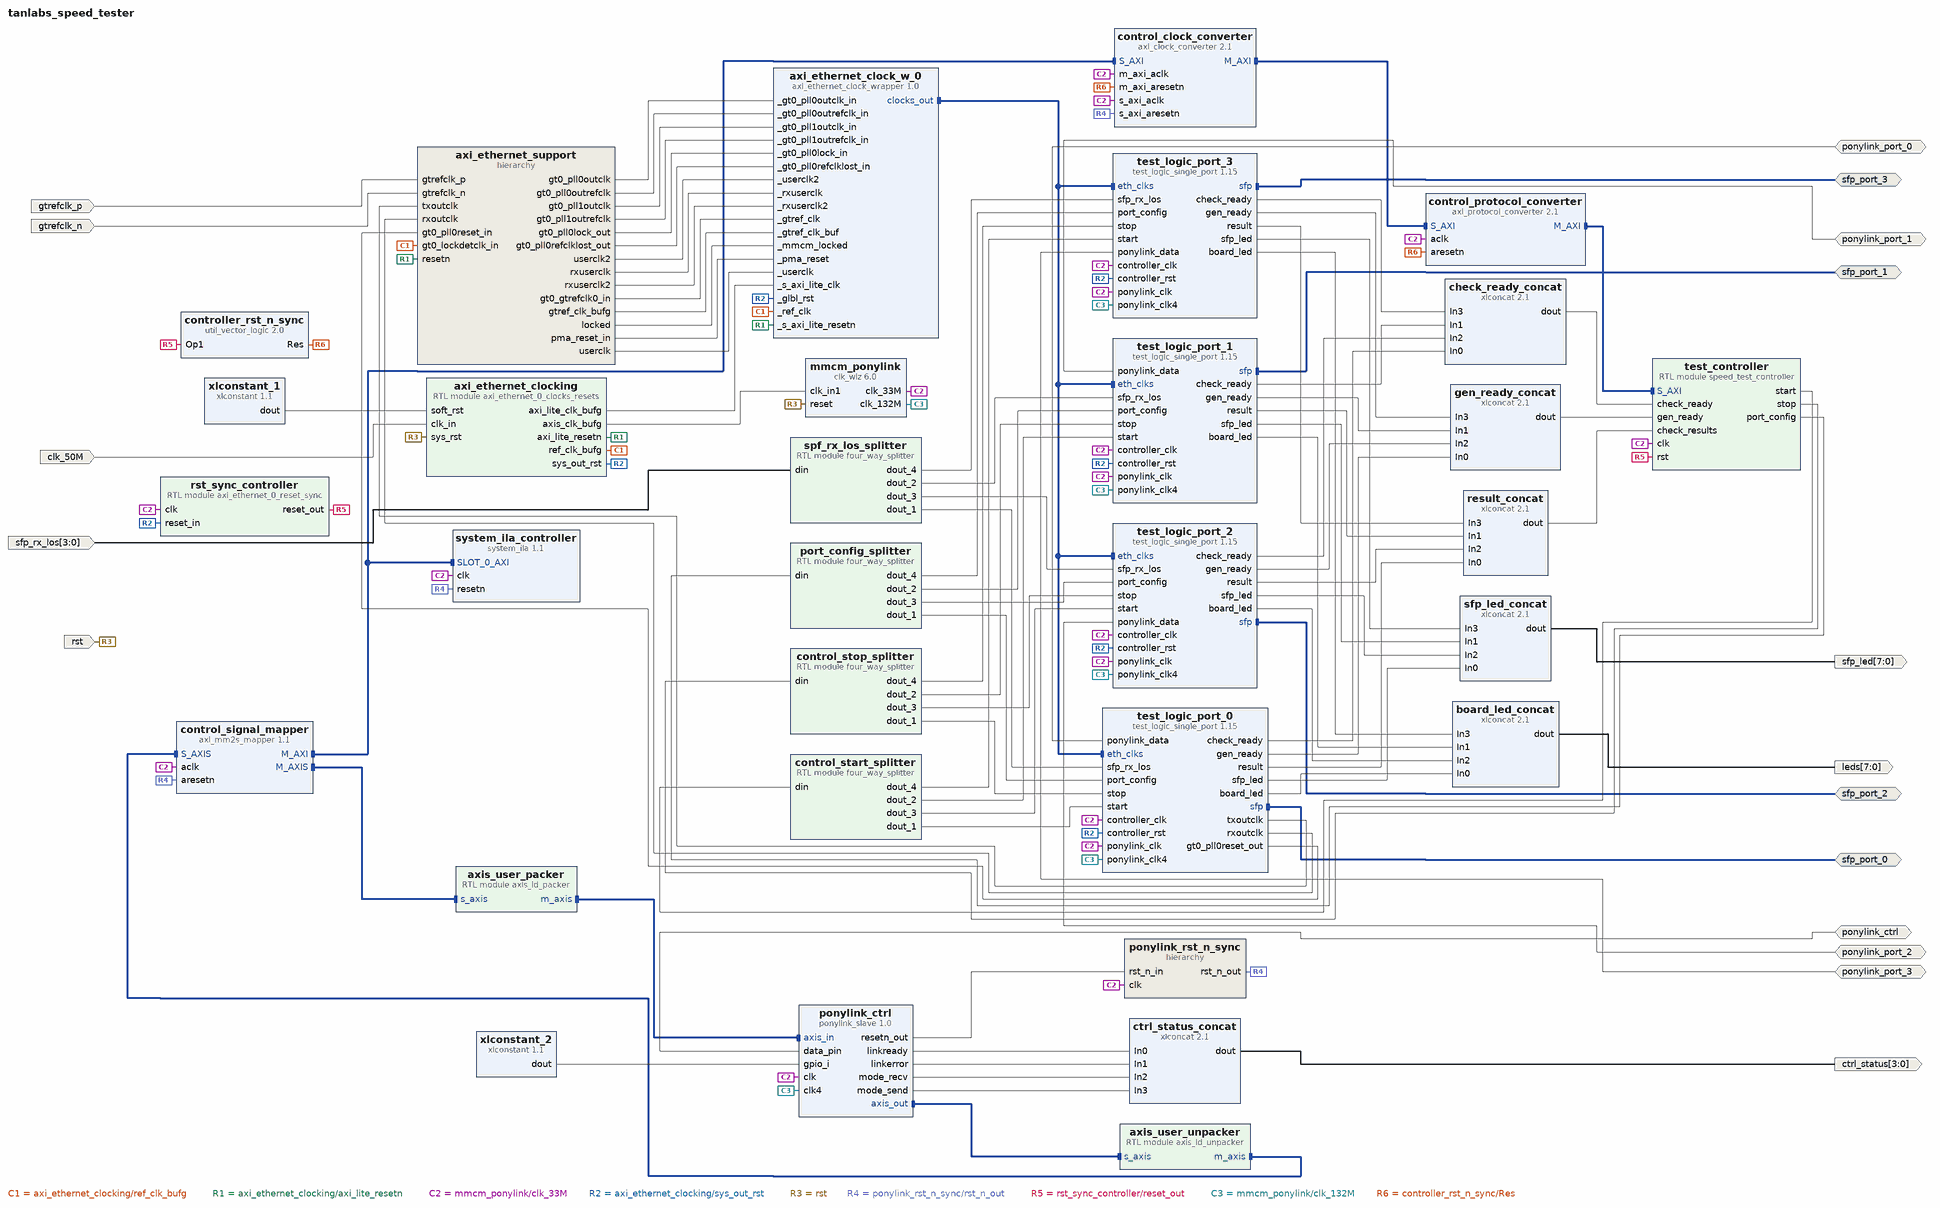
[diagram p0: block diagram of the top level]
# Vivado block design tanlabs_speed_tester, xc7a200tfbg676-2, Vivado 2019.2
create_bd_design tanlabs_speed_tester

create_bd_intf_port -mode Master -vlnv xilinx.com:interface:sfp_rtl:1.0 sfp_port_0
create_bd_intf_port -mode Master -vlnv xilinx.com:interface:sfp_rtl:1.0 sfp_port_1
create_bd_intf_port -mode Master -vlnv xilinx.com:interface:sfp_rtl:1.0 sfp_port_2
create_bd_intf_port -mode Master -vlnv xilinx.com:interface:sfp_rtl:1.0 sfp_port_3
create_bd_port -dir IO -type data ponylink_port_0
create_bd_port -dir IO -type data ponylink_port_1
create_bd_port -dir IO -type data ponylink_port_2
create_bd_port -dir IO -type data ponylink_port_3
create_bd_port -dir IO -type data ponylink_ctrl
create_bd_port -dir I -from 3 -to 0 -type data sfp_rx_los
create_bd_port -dir O -from 7 -to 0 -type data sfp_led
create_bd_port -dir I -type clk gtrefclk_p
set_property -dict {CONFIG.FREQ_HZ 125000000} [get_bd_ports gtrefclk_p]
create_bd_port -dir I -type clk gtrefclk_n
set_property -dict {CONFIG.FREQ_HZ 125000000} [get_bd_ports gtrefclk_n]
create_bd_port -dir I -type clk clk_50M
set_property -dict {CONFIG.FREQ_HZ 50000000} [get_bd_ports clk_50M]
create_bd_port -dir I -type rst rst
set_property -dict {CONFIG.POLARITY ACTIVE_HIGH} [get_bd_ports rst]
create_bd_port -dir O -from 7 -to 0 -type data leds
create_bd_port -dir O -from 3 -to 0 -type data ctrl_status

create_bd_cell -type ip -vlnv xilinx.com:ip:xlconcat:2.1 sfp_led_concat
set_property -dict {CONFIG.NUM_PORTS 4} [get_bd_cells sfp_led_concat]
create_bd_cell -type hier axi_ethernet_support
create_bd_cell -type ip -vlnv xilinx.com:ip:clk_wiz:6.0 mmcm_ponylink
set_property -dict [list \
  CONFIG.CLKIN1_JITTER_PS 100.0 \
  CONFIG.CLKOUT1_JITTER 439.249 \
  CONFIG.CLKOUT1_PHASE_ERROR 342.480 \
  CONFIG.CLKOUT1_REQUESTED_OUT_FREQ 33.000 \
  CONFIG.CLKOUT1_USED true \
  CONFIG.CLKOUT2_JITTER 330.205 \
  CONFIG.CLKOUT2_PHASE_ERROR 342.480 \
  CONFIG.CLKOUT2_REQUESTED_OUT_FREQ 132.000 \
  CONFIG.CLKOUT2_USED true \
  CONFIG.CLKOUT3_JITTER 142.107 \
  CONFIG.CLKOUT3_PHASE_ERROR 164.985 \
  CONFIG.CLKOUT3_REQUESTED_OUT_FREQ 100.000 \
  CONFIG.CLKOUT3_USED false \
  CONFIG.CLKOUT4_JITTER 204.383 \
  CONFIG.CLKOUT4_PHASE_ERROR 164.985 \
  CONFIG.CLKOUT4_REQUESTED_OUT_FREQ 100.000 \
  CONFIG.CLKOUT4_USED false \
  CONFIG.CLKOUT5_JITTER 146.458 \
  CONFIG.CLKOUT5_PHASE_ERROR 164.985 \
  CONFIG.CLKOUT5_REQUESTED_OUT_FREQ 100.000 \
  CONFIG.CLKOUT5_USED false \
  CONFIG.CLK_OUT1_PORT clk_33M \
  CONFIG.CLK_OUT2_PORT clk_132M \
  CONFIG.MMCM_CLKFBOUT_MULT_F 33.000 \
  CONFIG.MMCM_CLKIN1_PERIOD 10.000 \
  CONFIG.MMCM_CLKIN2_PERIOD 10.000 \
  CONFIG.MMCM_CLKOUT0_DIVIDE_F 20.000 \
  CONFIG.MMCM_CLKOUT1_DIVIDE 5 \
  CONFIG.MMCM_CLKOUT2_DIVIDE 1 \
  CONFIG.MMCM_CLKOUT3_DIVIDE 1 \
  CONFIG.MMCM_CLKOUT4_DIVIDE 1 \
  CONFIG.MMCM_DIVCLK_DIVIDE 5 \
  CONFIG.NUM_OUT_CLKS 2 \
] [get_bd_cells mmcm_ponylink]
create_bd_cell -type ip -vlnv xilinx.com:ip:xlconcat:2.1 board_led_concat
set_property -dict {CONFIG.NUM_PORTS 4} [get_bd_cells board_led_concat]
create_bd_cell -type module -reference axi_ethernet_0_clocks_resets axi_ethernet_clocking
create_bd_cell -type ip -vlnv xilinx.com:ip:xlconstant:1.1 xlconstant_1
set_property -dict {CONFIG.CONST_VAL 0} [get_bd_cells xlconstant_1]
create_bd_cell -type ip -vlnv clifford.at:cliffordwolf:ponylink_slave:1.0 ponylink_ctrl
set_property -dict [list \
  CONFIG.MASTER_PARBITS 4 \
  CONFIG.MASTER_TIMINGS 0x09070503010907050301 \
  CONFIG.SLAVE_PARBITS 4 \
  CONFIG.SLAVE_TIMINGS 0x0d0a0705020b09060301 \
  CONFIG.TDATA_WIDTH 8 \
  CONFIG.TUSER_WIDTH 4 \
] [get_bd_cells ponylink_ctrl]
create_bd_cell -type ip -vlnv xilinx.com:ip:axi_mm2s_mapper:1.1 control_signal_mapper
set_property -dict {CONFIG.DATA_WIDTH 32 CONFIG.ID_WIDTH 12 CONFIG.INTERFACES M_AXI} [get_bd_cells control_signal_mapper]
create_bd_cell -type ip -vlnv xilinx.com:ip:xlconstant:1.1 xlconstant_2
set_property -dict {CONFIG.CONST_WIDTH 8} [get_bd_cells xlconstant_2]
create_bd_cell -type module -reference axi_ethernet_0_reset_sync rst_sync_controller
create_bd_cell -type ip -vlnv xilinx.com:ip:xlconcat:2.1 gen_ready_concat
set_property -dict {CONFIG.NUM_PORTS 4} [get_bd_cells gen_ready_concat]
create_bd_cell -type ip -vlnv xilinx.com:ip:xlconcat:2.1 check_ready_concat
set_property -dict {CONFIG.NUM_PORTS 4} [get_bd_cells check_ready_concat]
create_bd_cell -type ip -vlnv xilinx.com:ip:xlconcat:2.1 result_concat
set_property -dict {CONFIG.NUM_PORTS 4} [get_bd_cells result_concat]
create_bd_cell -type ip -vlnv harrychen.xyz:user:axi_ethernet_clock_wrapper:1.0 axi_ethernet_clock_w_0
create_bd_cell -type module -reference four_way_splitter control_start_splitter
create_bd_cell -type module -reference four_way_splitter control_stop_splitter
create_bd_cell -type module -reference four_way_splitter port_config_splitter
set_property -dict {CONFIG.LENGTH 1024} [get_bd_cells port_config_splitter]
create_bd_cell -type module -reference four_way_splitter spf_rx_los_splitter
create_bd_cell -type module -reference axis_id_unpacker axis_user_unpacker
set_property -dict {CONFIG.TID_WIDTH 3 CONFIG.TUSER_WIDTH 4} [get_bd_cells axis_user_unpacker]
create_bd_cell -type ip -vlnv xilinx.com:ip:xlconcat:2.1 ctrl_status_concat
set_property -dict {CONFIG.NUM_PORTS 4} [get_bd_cells ctrl_status_concat]
create_bd_cell -type ip -vlnv xilinx.com:ip:axi_clock_converter:2.1 control_clock_converter
create_bd_cell -type ip -vlnv xilinx.com:ip:axi_protocol_converter:2.1 control_protocol_converter
create_bd_cell -type module -reference axis_id_packer axis_user_packer
set_property -dict {CONFIG.TID_WIDTH 3 CONFIG.TUSER_WIDTH 4} [get_bd_cells axis_user_packer]
create_bd_cell -type ip -vlnv xilinx.com:ip:system_ila:1.1 system_ila_controller
set_property -dict [list \
  CONFIG.C_MON_TYPE INTERFACE \
  CONFIG.C_NUM_MONITOR_SLOTS 1 \
  CONFIG.C_SLOT_0_APC_EN 1 \
  CONFIG.C_SLOT_0_AXI_AR_SEL_DATA 1 \
  CONFIG.C_SLOT_0_AXI_AR_SEL_TRIG 1 \
  CONFIG.C_SLOT_0_AXI_AW_SEL_DATA 1 \
  CONFIG.C_SLOT_0_AXI_AW_SEL_TRIG 1 \
  CONFIG.C_SLOT_0_AXI_B_SEL_DATA 1 \
  CONFIG.C_SLOT_0_AXI_B_SEL_TRIG 1 \
  CONFIG.C_SLOT_0_AXI_R_SEL_DATA 1 \
  CONFIG.C_SLOT_0_AXI_R_SEL_TRIG 1 \
  CONFIG.C_SLOT_0_AXI_W_SEL_DATA 1 \
  CONFIG.C_SLOT_0_AXI_W_SEL_TRIG 1 \
  CONFIG.C_SLOT_0_INTF_TYPE xilinx.com:interface:aximm_rtl:1.0 \
] [get_bd_cells system_ila_controller]
create_bd_cell -type module -reference speed_test_controller test_controller
set_property -dict {CONFIG.CLOCK_FREQ 33000000 CONFIG.C_S_AXI_ADDR_WIDTH 12} [get_bd_cells test_controller]
create_bd_cell -type hier ponylink_rst_n_sync
create_bd_cell -type ip -vlnv xilinx.com:ip:util_vector_logic:2.0 controller_rst_n_sync
set_property -dict {CONFIG.C_OPERATION not CONFIG.C_SIZE 1} [get_bd_cells controller_rst_n_sync]
create_bd_cell -type ip -vlnv harrychen.xyz:user:test_logic_single_port:1.15 test_logic_port_1
create_bd_cell -type ip -vlnv harrychen.xyz:user:test_logic_single_port:1.15 test_logic_port_2
create_bd_cell -type ip -vlnv harrychen.xyz:user:test_logic_single_port:1.15 test_logic_port_3
create_bd_cell -type ip -vlnv harrychen.xyz:user:test_logic_single_port:1.15 test_logic_port_0

# ---- hierarchy /axi_ethernet_support ----
current_bd_instance /axi_ethernet_support
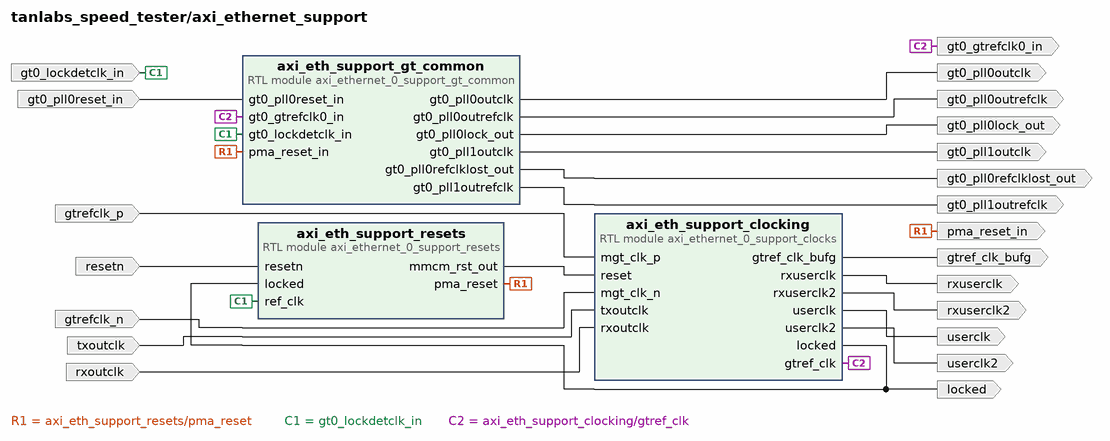
[diagram p1: block diagram inside /axi_ethernet_support]
create_bd_pin -dir O pma_reset_in
create_bd_pin -dir O locked
create_bd_pin -dir I gt0_lockdetclk_in
create_bd_pin -dir I -type rst resetn
create_bd_pin -dir I -type clk gtrefclk_p
create_bd_pin -dir I -type clk gtrefclk_n
create_bd_pin -dir I txoutclk
create_bd_pin -dir I rxoutclk
create_bd_pin -dir O userclk
create_bd_pin -dir O userclk2
create_bd_pin -dir O rxuserclk
create_bd_pin -dir O rxuserclk2
create_bd_pin -dir O gt0_gtrefclk0_in
create_bd_pin -dir O gtref_clk_bufg
create_bd_pin -dir O gt0_pll0outclk
create_bd_pin -dir O gt0_pll0outrefclk
create_bd_pin -dir O gt0_pll1outclk
create_bd_pin -dir O gt0_pll1outrefclk
create_bd_pin -dir O gt0_pll0lock_out
create_bd_pin -dir O gt0_pll0refclklost_out
create_bd_pin -dir I gt0_pll0reset_in

create_bd_cell -type module -reference axi_ethernet_0_support_resets axi_eth_support_resets
create_bd_cell -type module -reference axi_ethernet_0_support_gt_common axi_eth_support_gt_common
create_bd_cell -type module -reference axi_ethernet_0_support_clocks axi_eth_support_clocking

# ---- hierarchy /ponylink_rst_n_sync ----
current_bd_instance /ponylink_rst_n_sync
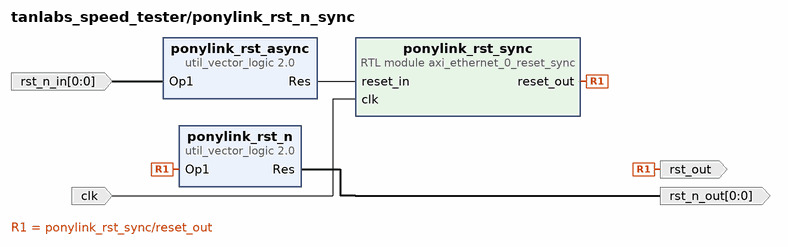
[diagram p2: block diagram inside /ponylink_rst_n_sync]
create_bd_pin -dir I -type clk clk
create_bd_pin -dir O -from 0 -to 0 rst_n_out
create_bd_pin -dir I -from 0 -to 0 rst_n_in
create_bd_pin -dir O -type rst rst_out

create_bd_cell -type module -reference axi_ethernet_0_reset_sync ponylink_rst_sync
create_bd_cell -type ip -vlnv xilinx.com:ip:util_vector_logic:2.0 ponylink_rst_n
set_property -dict {CONFIG.C_OPERATION not CONFIG.C_SIZE 1} [get_bd_cells ponylink_rst_n]
create_bd_cell -type ip -vlnv xilinx.com:ip:util_vector_logic:2.0 ponylink_rst_async
set_property -dict {CONFIG.C_OPERATION not CONFIG.C_SIZE 1} [get_bd_cells ponylink_rst_async]

# ---- connections ----

current_bd_instance /axi_ethernet_support
connect_bd_net -net axi_ethernet_0_suppo_0_mmcm_rst_out [get_bd_pins axi_eth_support_resets/mmcm_rst_out] [get_bd_pins axi_eth_support_clocking/reset]
connect_bd_net -net axi_ethernet_0_suppo_0_pma_reset [get_bd_pins axi_eth_support_resets/pma_reset] \
  [get_bd_pins pma_reset_in] [get_bd_pins axi_eth_support_gt_common/pma_reset_in]
connect_bd_net -net axi_ethernet_0_suppo_0_locked [get_bd_pins axi_eth_support_clocking/locked] \
  [get_bd_pins locked] [get_bd_pins axi_eth_support_resets/locked]
connect_bd_net [get_bd_pins gt0_lockdetclk_in] [get_bd_pins axi_eth_support_gt_common/gt0_lockdetclk_in] [get_bd_pins axi_eth_support_resets/ref_clk]
connect_bd_net [get_bd_pins resetn] [get_bd_pins axi_eth_support_resets/resetn]
connect_bd_net [get_bd_pins gtrefclk_p] [get_bd_pins axi_eth_support_clocking/mgt_clk_p]
connect_bd_net [get_bd_pins gtrefclk_n] [get_bd_pins axi_eth_support_clocking/mgt_clk_n]
connect_bd_net -net test_logic_single_po_0_txoutclk [get_bd_pins txoutclk] [get_bd_pins axi_eth_support_clocking/txoutclk]
connect_bd_net -net test_logic_single_po_0_rxoutclk [get_bd_pins rxoutclk] [get_bd_pins axi_eth_support_clocking/rxoutclk]
connect_bd_net -net axi_ethernet_0_suppo_0_userclk [get_bd_pins axi_eth_support_clocking/userclk] [get_bd_pins userclk]
connect_bd_net -net axi_ethernet_0_suppo_0_userclk2 [get_bd_pins axi_eth_support_clocking/userclk2] [get_bd_pins userclk2]
connect_bd_net -net axi_ethernet_0_suppo_0_rxuserclk [get_bd_pins axi_eth_support_clocking/rxuserclk] [get_bd_pins rxuserclk]
connect_bd_net -net axi_ethernet_0_suppo_0_rxuserclk2 [get_bd_pins axi_eth_support_clocking/rxuserclk2] [get_bd_pins rxuserclk2]
connect_bd_net -net axi_ethernet_0_suppo_0_gtref_clk [get_bd_pins axi_eth_support_clocking/gtref_clk] \
  [get_bd_pins gt0_gtrefclk0_in] [get_bd_pins axi_eth_support_gt_common/gt0_gtrefclk0_in]
connect_bd_net -net axi_ethernet_0_suppo_0_gtref_clk_bufg [get_bd_pins axi_eth_support_clocking/gtref_clk_bufg] [get_bd_pins gtref_clk_bufg]
connect_bd_net -net axi_ethernet_0_suppo_0_gt0_pll0outclk [get_bd_pins axi_eth_support_gt_common/gt0_pll0outclk] [get_bd_pins gt0_pll0outclk]
connect_bd_net -net axi_ethernet_0_suppo_0_gt0_pll0outrefclk [get_bd_pins axi_eth_support_gt_common/gt0_pll0outrefclk] [get_bd_pins gt0_pll0outrefclk]
connect_bd_net -net axi_ethernet_0_suppo_0_gt0_pll1outclk [get_bd_pins axi_eth_support_gt_common/gt0_pll1outclk] [get_bd_pins gt0_pll1outclk]
connect_bd_net -net axi_ethernet_0_suppo_0_gt0_pll1outrefclk [get_bd_pins axi_eth_support_gt_common/gt0_pll1outrefclk] [get_bd_pins gt0_pll1outrefclk]
connect_bd_net -net axi_ethernet_0_suppo_0_gt0_pll0lock_out [get_bd_pins axi_eth_support_gt_common/gt0_pll0lock_out] [get_bd_pins gt0_pll0lock_out]
connect_bd_net -net axi_ethernet_0_suppo_0_gt0_pll0refclklost_out [get_bd_pins axi_eth_support_gt_common/gt0_pll0refclklost_out] \
  [get_bd_pins gt0_pll0refclklost_out]
connect_bd_net -net test_logic_single_po_0_gt0_pll0reset_out [get_bd_pins gt0_pll0reset_in] [get_bd_pins axi_eth_support_gt_common/gt0_pll0reset_in]

current_bd_instance /ponylink_rst_n_sync
connect_bd_net -net util_vector_logic_0_Res1 [get_bd_pins ponylink_rst_async/Res] [get_bd_pins ponylink_rst_sync/reset_in]
connect_bd_net -net rx_reset_sync1_reset_out [get_bd_pins ponylink_rst_sync/reset_out] [get_bd_pins ponylink_rst_n/Op1] [get_bd_pins rst_out]
connect_bd_net -net ponylink_clk [get_bd_pins clk] [get_bd_pins ponylink_rst_sync/clk]
connect_bd_net [get_bd_pins ponylink_rst_n/Res] [get_bd_pins rst_n_out]
connect_bd_net -net ponylink_to_zynq_resetn_out [get_bd_pins rst_n_in] [get_bd_pins ponylink_rst_async/Op1]

current_bd_instance /
connect_bd_intf_net [get_bd_intf_pins control_signal_mapper/M_AXIS] [get_bd_intf_pins axis_user_packer/s_axis]
connect_bd_intf_net [get_bd_intf_ports sfp_port_3] [get_bd_intf_pins test_logic_port_3/sfp]
connect_bd_intf_net [get_bd_intf_ports sfp_port_1] [get_bd_intf_pins test_logic_port_1/sfp]
connect_bd_intf_net -intf_net axis_id_packer_0_m_axis [get_bd_intf_pins axis_user_packer/m_axis] [get_bd_intf_pins ponylink_ctrl/axis_in]
connect_bd_intf_net -intf_net axi_clock_converter_0_M_AXI [get_bd_intf_pins control_clock_converter/M_AXI] [get_bd_intf_pins control_protocol_converter/S_AXI]
connect_bd_intf_net -intf_net axis_id_unpacker_0_m_axis [get_bd_intf_pins axis_user_unpacker/m_axis] [get_bd_intf_pins control_signal_mapper/S_AXIS]
connect_bd_intf_net [get_bd_intf_ports sfp_port_0] [get_bd_intf_pins test_logic_port_0/sfp]
connect_bd_intf_net [get_bd_intf_pins ponylink_ctrl/axis_out] [get_bd_intf_pins axis_user_unpacker/s_axis]
connect_bd_intf_net -intf_net axi_protocol_convert_0_M_AXI [get_bd_intf_pins control_protocol_converter/M_AXI] [get_bd_intf_pins test_controller/S_AXI]
connect_bd_intf_net [get_bd_intf_ports sfp_port_2] [get_bd_intf_pins test_logic_port_2/sfp]
connect_bd_intf_net -intf_net control_signal_mapper_M_AXI [get_bd_intf_pins control_signal_mapper/M_AXI] [get_bd_intf_pins control_clock_converter/S_AXI]
connect_bd_intf_net [get_bd_intf_pins control_signal_mapper/M_AXI] [get_bd_intf_pins system_ila_controller/SLOT_0_AXI]
connect_bd_intf_net [get_bd_intf_pins axi_ethernet_clock_w_0/clocks_out] [get_bd_intf_pins test_logic_port_1/eth_clks]
connect_bd_intf_net [get_bd_intf_pins axi_ethernet_clock_w_0/clocks_out] [get_bd_intf_pins test_logic_port_2/eth_clks]
connect_bd_intf_net [get_bd_intf_pins axi_ethernet_clock_w_0/clocks_out] [get_bd_intf_pins test_logic_port_3/eth_clks]
connect_bd_intf_net [get_bd_intf_pins axi_ethernet_clock_w_0/clocks_out] [get_bd_intf_pins test_logic_port_0/eth_clks]
connect_bd_net [get_bd_ports sfp_rx_los] [get_bd_pins spf_rx_los_splitter/din]
connect_bd_net -net xlconcat_0_dout [get_bd_pins sfp_led_concat/dout] [get_bd_ports sfp_led]
connect_bd_net -net axi_ethernet_0_suppo_0_gt0_pll0outclk [get_bd_pins axi_ethernet_support/gt0_pll0outclk] \
  [get_bd_pins axi_ethernet_clock_w_0/_gt0_pll0outclk_in]
connect_bd_net -net axi_ethernet_0_suppo_0_gt0_pll0outrefclk [get_bd_pins axi_ethernet_support/gt0_pll0outrefclk] \
  [get_bd_pins axi_ethernet_clock_w_0/_gt0_pll0outrefclk_in]
connect_bd_net -net axi_ethernet_0_suppo_0_gt0_pll1outclk [get_bd_pins axi_ethernet_support/gt0_pll1outclk] \
  [get_bd_pins axi_ethernet_clock_w_0/_gt0_pll1outclk_in]
connect_bd_net -net axi_ethernet_0_suppo_0_gt0_pll1outrefclk [get_bd_pins axi_ethernet_support/gt0_pll1outrefclk] \
  [get_bd_pins axi_ethernet_clock_w_0/_gt0_pll1outrefclk_in]
connect_bd_net -net axi_ethernet_0_suppo_0_gt0_pll0lock_out [get_bd_pins axi_ethernet_support/gt0_pll0lock_out] \
  [get_bd_pins axi_ethernet_clock_w_0/_gt0_pll0lock_in]
connect_bd_net -net axi_ethernet_0_suppo_0_gt0_pll0refclklost_out [get_bd_pins axi_ethernet_support/gt0_pll0refclklost_out] \
  [get_bd_pins axi_ethernet_clock_w_0/_gt0_pll0refclklost_in]
connect_bd_net -net axi_ethernet_0_suppo_0_userclk2 [get_bd_pins axi_ethernet_support/userclk2] [get_bd_pins axi_ethernet_clock_w_0/_userclk2]
connect_bd_net -net axi_ethernet_0_suppo_0_rxuserclk [get_bd_pins axi_ethernet_support/rxuserclk] [get_bd_pins axi_ethernet_clock_w_0/_rxuserclk]
connect_bd_net -net axi_ethernet_0_suppo_0_rxuserclk2 [get_bd_pins axi_ethernet_support/rxuserclk2] [get_bd_pins axi_ethernet_clock_w_0/_rxuserclk2]
connect_bd_net -net axi_ethernet_0_suppo_0_gtref_clk [get_bd_pins axi_ethernet_support/gt0_gtrefclk0_in] \
  [get_bd_pins axi_ethernet_clock_w_0/_gtref_clk]
connect_bd_net -net axi_ethernet_0_suppo_0_gtref_clk_bufg [get_bd_pins axi_ethernet_support/gtref_clk_bufg] \
  [get_bd_pins axi_ethernet_clock_w_0/_gtref_clk_buf]
connect_bd_net -net axi_ethernet_0_suppo_0_locked [get_bd_pins axi_ethernet_support/locked] [get_bd_pins axi_ethernet_clock_w_0/_mmcm_locked]
connect_bd_net -net axi_ethernet_0_suppo_0_pma_reset [get_bd_pins axi_ethernet_support/pma_reset_in] [get_bd_pins axi_ethernet_clock_w_0/_pma_reset]
connect_bd_net [get_bd_pins axi_ethernet_clocking/ref_clk_bufg] \
  [get_bd_pins axi_ethernet_support/gt0_lockdetclk_in] [get_bd_pins axi_ethernet_clock_w_0/_ref_clk]
connect_bd_net [get_bd_ports gtrefclk_p] [get_bd_pins axi_ethernet_support/gtrefclk_p]
connect_bd_net [get_bd_ports gtrefclk_n] [get_bd_pins axi_ethernet_support/gtrefclk_n]
connect_bd_net [get_bd_pins axi_ethernet_clocking/axi_lite_resetn] \
  [get_bd_pins axi_ethernet_support/resetn] [get_bd_pins axi_ethernet_clock_w_0/_s_axi_lite_resetn]
connect_bd_net -net clk_ponylink_clk_40M [get_bd_pins mmcm_ponylink/clk_33M] \
  [get_bd_pins ponylink_ctrl/clk] [get_bd_pins control_signal_mapper/aclk] [get_bd_pins control_clock_converter/s_axi_aclk] \
  [get_bd_pins system_ila_controller/clk] [get_bd_pins ponylink_rst_n_sync/clk] [get_bd_pins test_controller/clk] \
  [get_bd_pins control_protocol_converter/aclk] [get_bd_pins control_clock_converter/m_axi_aclk] \
  [get_bd_pins rst_sync_controller/clk] [get_bd_pins test_logic_port_1/controller_clk] \
  [get_bd_pins test_logic_port_1/ponylink_clk] [get_bd_pins test_logic_port_2/controller_clk] \
  [get_bd_pins test_logic_port_2/ponylink_clk] [get_bd_pins test_logic_port_3/controller_clk] \
  [get_bd_pins test_logic_port_3/ponylink_clk] [get_bd_pins test_logic_port_0/controller_clk] \
  [get_bd_pins test_logic_port_0/ponylink_clk]
connect_bd_net [get_bd_ports clk_50M] [get_bd_pins axi_ethernet_clocking/clk_in]
connect_bd_net -net axi_ethernet_0_clock_0_sys_out_rst [get_bd_pins axi_ethernet_clocking/sys_out_rst] \
  [get_bd_pins rst_sync_controller/reset_in] [get_bd_pins axi_ethernet_clock_w_0/_glbl_rst] \
  [get_bd_pins test_logic_port_1/controller_rst] [get_bd_pins test_logic_port_2/controller_rst] \
  [get_bd_pins test_logic_port_3/controller_rst] [get_bd_pins test_logic_port_0/controller_rst]
connect_bd_net -net axi_ethernet_0_clock_0_axi_lite_clk_bufg [get_bd_pins axi_ethernet_clocking/axi_lite_clk_bufg] \
  [get_bd_pins axi_ethernet_clock_w_0/_s_axi_lite_clk]
connect_bd_net [get_bd_ports rst] [get_bd_pins mmcm_ponylink/reset] [get_bd_pins axi_ethernet_clocking/sys_rst]
connect_bd_net [get_bd_pins board_led_concat/dout] [get_bd_ports leds]
connect_bd_net [get_bd_pins xlconstant_1/dout] [get_bd_pins axi_ethernet_clocking/soft_rst]
connect_bd_net [get_bd_ports ponylink_ctrl] [get_bd_pins ponylink_ctrl/data_pin]
connect_bd_net -net ponylink_to_zynq_resetn_out [get_bd_pins ponylink_rst_n_sync/rst_n_out] \
  [get_bd_pins control_signal_mapper/aresetn] [get_bd_pins control_clock_converter/s_axi_aresetn] \
  [get_bd_pins system_ila_controller/resetn]
connect_bd_net [get_bd_pins xlconstant_2/dout] [get_bd_pins ponylink_ctrl/gpio_i]
connect_bd_net -net axi_ethernet_0_reset_0_reset_out [get_bd_pins rst_sync_controller/reset_out] \
  [get_bd_pins test_controller/rst] [get_bd_pins controller_rst_n_sync/Op1]
connect_bd_net [get_bd_pins test_controller/start] [get_bd_pins control_start_splitter/din]
connect_bd_net [get_bd_pins test_controller/stop] [get_bd_pins control_stop_splitter/din]
connect_bd_net [get_bd_pins gen_ready_concat/dout] [get_bd_pins test_controller/gen_ready]
connect_bd_net [get_bd_pins check_ready_concat/dout] [get_bd_pins test_controller/check_ready]
connect_bd_net [get_bd_pins result_concat/dout] [get_bd_pins test_controller/check_results]
connect_bd_net [get_bd_pins test_controller/port_config] [get_bd_pins port_config_splitter/din]
connect_bd_net [get_bd_pins mmcm_ponylink/clk_132M] \
  [get_bd_pins ponylink_ctrl/clk4] [get_bd_pins test_logic_port_1/ponylink_clk4] \
  [get_bd_pins test_logic_port_2/ponylink_clk4] [get_bd_pins test_logic_port_3/ponylink_clk4] \
  [get_bd_pins test_logic_port_0/ponylink_clk4]
connect_bd_net [get_bd_pins axi_ethernet_clocking/axis_clk_bufg] [get_bd_pins mmcm_ponylink/clk_in1]
connect_bd_net [get_bd_pins ponylink_ctrl/linkready] [get_bd_pins ctrl_status_concat/In0]
connect_bd_net [get_bd_pins ponylink_ctrl/linkerror] [get_bd_pins ctrl_status_concat/In1]
connect_bd_net [get_bd_pins ponylink_ctrl/mode_recv] [get_bd_pins ctrl_status_concat/In2]
connect_bd_net [get_bd_pins ponylink_ctrl/mode_send] [get_bd_pins ctrl_status_concat/In3]
connect_bd_net [get_bd_pins ctrl_status_concat/dout] [get_bd_ports ctrl_status]
connect_bd_net -net eth_reset_n_Res [get_bd_pins controller_rst_n_sync/Res] \
  [get_bd_pins control_clock_converter/m_axi_aresetn] [get_bd_pins control_protocol_converter/aresetn]
connect_bd_net [get_bd_ports ponylink_port_1] [get_bd_pins test_logic_port_1/ponylink_data]
connect_bd_net [get_bd_pins test_logic_port_1/sfp_led] [get_bd_pins sfp_led_concat/In1]
connect_bd_net [get_bd_pins test_logic_port_1/board_led] [get_bd_pins board_led_concat/In1]
connect_bd_net [get_bd_pins control_stop_splitter/dout_2] [get_bd_pins test_logic_port_1/stop]
connect_bd_net [get_bd_pins port_config_splitter/dout_2] [get_bd_pins test_logic_port_1/port_config]
connect_bd_net [get_bd_pins control_start_splitter/dout_2] [get_bd_pins test_logic_port_1/start]
connect_bd_net [get_bd_pins spf_rx_los_splitter/dout_2] [get_bd_pins test_logic_port_1/sfp_rx_los]
connect_bd_net [get_bd_pins test_logic_port_1/result] [get_bd_pins result_concat/In1]
connect_bd_net [get_bd_pins test_logic_port_1/check_ready] [get_bd_pins check_ready_concat/In1]
connect_bd_net [get_bd_pins test_logic_port_1/gen_ready] [get_bd_pins gen_ready_concat/In1]
connect_bd_net [get_bd_ports ponylink_port_2] [get_bd_pins test_logic_port_2/ponylink_data]
connect_bd_net [get_bd_pins test_logic_port_2/board_led] [get_bd_pins board_led_concat/In2]
connect_bd_net [get_bd_pins spf_rx_los_splitter/dout_3] [get_bd_pins test_logic_port_2/sfp_rx_los]
connect_bd_net [get_bd_pins control_stop_splitter/dout_3] [get_bd_pins test_logic_port_2/stop]
connect_bd_net [get_bd_pins port_config_splitter/dout_3] [get_bd_pins test_logic_port_2/port_config]
connect_bd_net [get_bd_pins control_start_splitter/dout_3] [get_bd_pins test_logic_port_2/start]
connect_bd_net [get_bd_pins test_logic_port_2/sfp_led] [get_bd_pins sfp_led_concat/In2]
connect_bd_net [get_bd_pins test_logic_port_2/check_ready] [get_bd_pins check_ready_concat/In2]
connect_bd_net [get_bd_pins test_logic_port_2/result] [get_bd_pins result_concat/In2]
connect_bd_net [get_bd_pins test_logic_port_2/gen_ready] [get_bd_pins gen_ready_concat/In2]
connect_bd_net [get_bd_pins ponylink_ctrl/resetn_out] [get_bd_pins ponylink_rst_n_sync/rst_n_in]
connect_bd_net [get_bd_pins port_config_splitter/dout_4] [get_bd_pins test_logic_port_3/port_config]
connect_bd_net [get_bd_pins spf_rx_los_splitter/dout_4] [get_bd_pins test_logic_port_3/sfp_rx_los]
connect_bd_net [get_bd_pins control_start_splitter/dout_4] [get_bd_pins test_logic_port_3/start]
connect_bd_net [get_bd_pins control_stop_splitter/dout_4] [get_bd_pins test_logic_port_3/stop]
connect_bd_net [get_bd_pins test_logic_port_3/check_ready] [get_bd_pins check_ready_concat/In3]
connect_bd_net [get_bd_pins test_logic_port_3/gen_ready] [get_bd_pins gen_ready_concat/In3]
connect_bd_net [get_bd_ports ponylink_port_3] [get_bd_pins test_logic_port_3/ponylink_data]
connect_bd_net [get_bd_pins test_logic_port_3/result] [get_bd_pins result_concat/In3]
connect_bd_net [get_bd_pins test_logic_port_3/board_led] [get_bd_pins board_led_concat/In3]
connect_bd_net [get_bd_pins test_logic_port_3/sfp_led] [get_bd_pins sfp_led_concat/In3]
connect_bd_net [get_bd_pins axi_ethernet_support/userclk] [get_bd_pins axi_ethernet_clock_w_0/_userclk]
connect_bd_net [get_bd_pins port_config_splitter/dout_1] [get_bd_pins test_logic_port_0/port_config]
connect_bd_net [get_bd_pins spf_rx_los_splitter/dout_1] [get_bd_pins test_logic_port_0/sfp_rx_los]
connect_bd_net [get_bd_pins control_stop_splitter/dout_1] [get_bd_pins test_logic_port_0/stop]
connect_bd_net [get_bd_pins control_start_splitter/dout_1] [get_bd_pins test_logic_port_0/start]
connect_bd_net [get_bd_pins test_logic_port_0/txoutclk] [get_bd_pins axi_ethernet_support/txoutclk]
connect_bd_net [get_bd_pins test_logic_port_0/rxoutclk] [get_bd_pins axi_ethernet_support/rxoutclk]
connect_bd_net [get_bd_pins test_logic_port_0/gt0_pll0reset_out] [get_bd_pins axi_ethernet_support/gt0_pll0reset_in]
connect_bd_net [get_bd_pins test_logic_port_0/check_ready] [get_bd_pins check_ready_concat/In0]
connect_bd_net [get_bd_pins test_logic_port_0/gen_ready] [get_bd_pins gen_ready_concat/In0]
connect_bd_net [get_bd_pins test_logic_port_0/board_led] [get_bd_pins board_led_concat/In0]
connect_bd_net [get_bd_pins test_logic_port_0/sfp_led] [get_bd_pins sfp_led_concat/In0]
connect_bd_net [get_bd_pins test_logic_port_0/result] [get_bd_pins result_concat/In0]
connect_bd_net [get_bd_ports ponylink_port_0] [get_bd_pins test_logic_port_0/ponylink_data]
set_property HDL_ATTRIBUTE.DEBUG true [get_bd_intf_nets control_signal_mapper_M_AXI]
set_property HDL_ATTRIBUTE.MARK_DEBUG true [get_bd_intf_nets control_signal_mapper_M_AXI]

# ---- address map ----
assign_bd_address -offset 0x42000000 -range 512 -target_address_space [get_bd_addr_spaces control_signal_mapper/Bridge] [get_bd_addr_segs test_controller/S_AXI/reg0]

validate_bd_design
save_bd_design
